# Altium schematic sheet LCL_12V_prec.SchDoc
size A4; Organization: Altium Limited; Address1: L3, 12a Rodborough Rd; Address2: Frenchs Forest; Address3: NSW; Address4: Australia 2086; DocumentNumber: 11; SheetNumber: 11; SheetTotal: 19
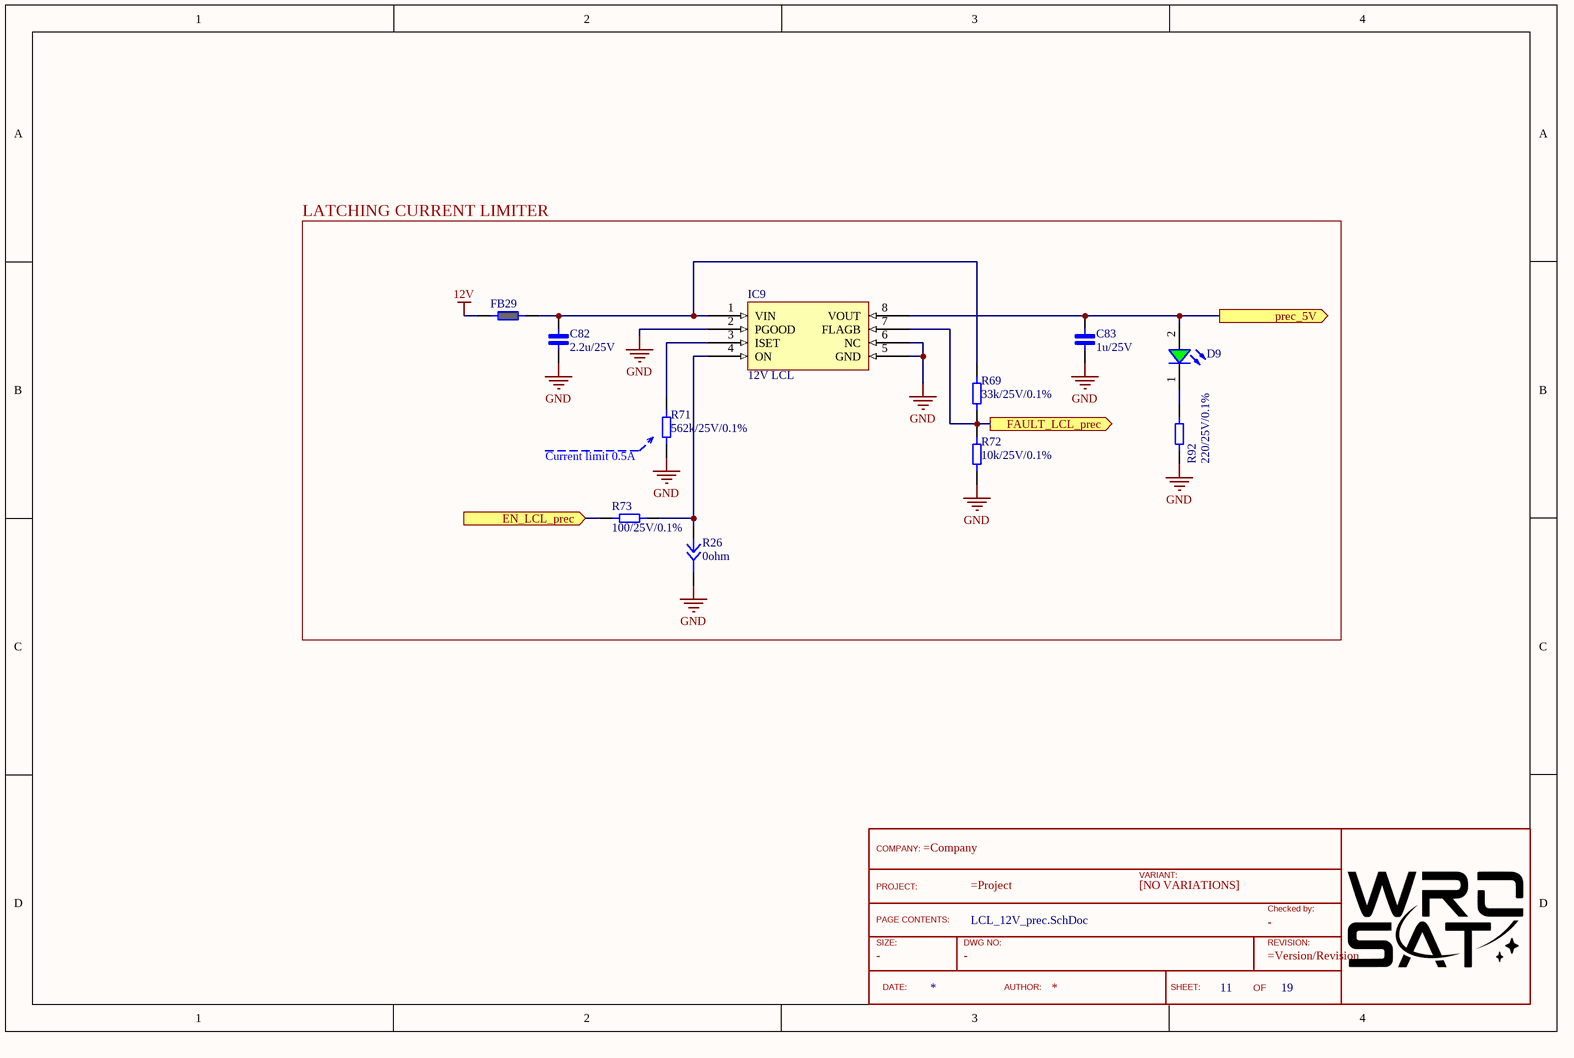
[diagram p0: LCL_12V_prec.SchDoc]

## Parts
?  TitleBlock  (value not drawn)  (graphical)
C82  2.2u/25V  [CAP_0603]
C83  1u/25V  [CAP_0603]
D9  Green, 3.2V  [WL-SMCW_0603_H=0.7mm]  (value not drawn)
FB29  Ferrite_bead_0603  [Ferrite_0603]  (value not drawn)
IC9  12V LCL  [SO8]
R26  0ohm  [Jumper 2]
R69  33k/25V/0.1%  [RES_0402]
R71  562k/25V/0.1%  [RES_0402]
R72  10k/25V/0.1%  [RES_0402]
R73  100/25V/0.1%  [RES_0402]
R92  220/25V/0.1%  [RES_0402]

## Blocks framed on the sheet
LATCHING CURRENT LIMITER: C82 C83 D9 FB29 IC9 R26 R69 R71-R73 R92

## Ports
EN_LCL_prec (in), FAULT_LCL_prec (out), prec_5V (out)

## Nets
12V: FB29.1
GND: C82.1 C83.1 IC9.2(PGOOD) IC9.5(GND) IC9.6(NC) R26.2 R71.1 R72.1 R92.1
EN_LCL_prec: R73.1 ; port EN_LCL_prec
FAULT_LCL_prec: IC9.7(FLAGB) R69.1 R72.2 ; port FAULT_LCL_prec
prec_5V: C83.2 D9.2(A) IC9.8(VOUT) ; port prec_5V
NetC82_2: C82.2 FB29.2 IC9.1(VIN) R69.2
NetD9_1: D9.1(K) R92.2
NetIC9_3: IC9.3(ISET) R71.2
NetIC9_4: IC9.4(ON) R26.1 R73.2

## Notes on the sheet
- (near R71) Current limit 0.5A
- Title
- Size:
- Date:
- A3
- Number:
- Time:
- Revision:
- Sheet
- of
- File:
- (in symbol TitleBlock) COMPANY:; VARIANT:; PROJECT:; [NO VARIATIONS]; Checked by:; PAGE CONTENTS:; SIZE:; DWG NO:; REVISION:; DATE:; AUTHOR:; SHEET:; OF

## Library data of the parts
? = TitleBlock: Standard TitleBlock; DrawingNo: -; Size: -; Checked: -
C82 = Cap_0603_2.2u_25v: Ceramic Capacitor 2.2uF / 0603 / 25V / ±5%, Wurth Elektronik MLCC
C83 = Cap_0603_1u_25v: Ceramic Capacitor 1uF / 0603 / 25V / ±5%, Wurth Elektronik MLCC
D9 = 150060GS75000: WL-SMCW SMT Mono-color Chip LED Waterclear, size 0603, Green, 3.2V, 140deg; Chip Technology: InGaN; Dominant Wavelength typ.: 525nm; Luminous Intensity typ.: 430mcd; Peak Wavelength typ.: 515nm; Viewing Angle: 140deg; ComponentLink1Description: Manufacturer; ComponentLink1URL: http://www.we-online.de; ComponentLink2URL: https://www.we-online.com/catalog/datasheet/150060GS75000.pdf; ComponentLink2Description: Datasheet; Forward Voltage typ.: 3.2V; Emitting Color: Green; Mounting Technology: SMT; Operating Temperature: -40 to +85degC; Published Date: December 2019; Part Number: 150060GS75000; Packaging: Tape and Reel; Size: 0603; Publisher: Wurth Elektronik
FB29 = Ferrite_bead_0603: Ferrite bead
IC9 = FPF2700: FPF270xMX
R26 = Mini jumper
R69 = Res_0402_33k: Vishay, thin film resistor 33k/25V/0.1%
R71 = Res_0402_562k: Vishay, thin film resistor 562k/25V/0.1%
R72 = Res_0402_10k: Vishay, thin film resistor 10k/25V/0.1%
R73 = Res_0402_100: Vishay, thin film resistor 100/25V/0.1%
R92 = Res_0402_1: Vishay, thin film resistor 1/25V/0.1%